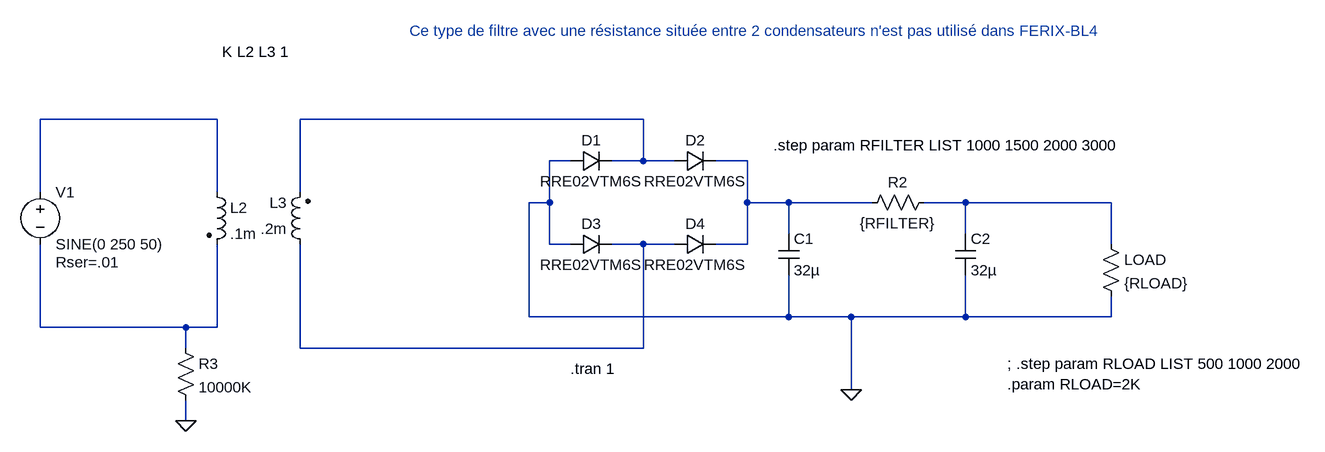
[diagram p0: schematic RectifierHT2.asc]
RectifierHT2.asc, the LTspice schematic file:
Version 4
SHEET 1 1316 692
WIRE -384 16 -656 16
WIRE 272 16 -256 16
WIRE 160 80 128 80
WIRE 272 80 272 16
WIRE 272 80 224 80
WIRE 320 80 272 80
WIRE 432 80 384 80
WIRE -656 128 -656 16
WIRE -384 128 -384 16
WIRE -256 128 -256 16
WIRE 128 144 128 80
WIRE 128 144 96 144
WIRE 432 144 432 80
WIRE 496 144 432 144
WIRE 624 144 496 144
WIRE 768 144 704 144
WIRE 992 144 768 144
WIRE 496 192 496 144
WIRE 768 192 768 144
WIRE 128 208 128 144
WIRE 160 208 128 208
WIRE 272 208 224 208
WIRE 320 208 272 208
WIRE 432 208 432 144
WIRE 432 208 384 208
WIRE 992 208 992 144
WIRE 96 320 96 144
WIRE 496 320 496 256
WIRE 496 320 96 320
WIRE 592 320 496 320
WIRE 768 320 768 256
WIRE 768 320 592 320
WIRE 992 320 992 288
WIRE 992 320 768 320
WIRE -656 336 -656 208
WIRE -432 336 -656 336
WIRE -384 336 -384 208
WIRE -384 336 -432 336
WIRE -432 368 -432 336
WIRE -256 368 -256 208
WIRE 272 368 272 208
WIRE 272 368 -256 368
WIRE 592 432 592 320
WIRE -432 480 -432 448
FLAG 592 432 0
FLAG -432 480 0
SYMBOL diode 160 96 R270
WINDOW 0 32 32 VTop 2
WINDOW 3 0 32 VBottom 2
SYMATTR InstName D1
SYMATTR Value RRE02VTM6S
SYMBOL diode 320 96 R270
WINDOW 0 32 32 VTop 2
WINDOW 3 0 32 VBottom 2
SYMATTR InstName D2
SYMATTR Value RRE02VTM6S
SYMBOL diode 160 224 R270
WINDOW 0 32 32 VTop 2
WINDOW 3 0 32 VBottom 2
SYMATTR InstName D3
SYMATTR Value RRE02VTM6S
SYMBOL diode 320 224 R270
WINDOW 0 32 32 VTop 2
WINDOW 3 0 32 VBottom 2
SYMATTR InstName D4
SYMATTR Value RRE02VTM6S
SYMBOL voltage -656 112 R0
WINDOW 123 0 0 Left 0
WINDOW 39 24 124 Left 2
SYMATTR SpiceLine Rser=.01
SYMATTR InstName V1
SYMATTR Value SINE(0 250 50)
SYMBOL res 976 192 R0
SYMATTR InstName LOAD
SYMATTR Value {RLOAD}
SYMBOL cap 480 192 R0
SYMATTR InstName C1
SYMATTR Value 32µ
SYMBOL ind2 -400 112 R0
SYMATTR InstName L2
SYMATTR Value .1m
SYMATTR Type ind
SYMBOL ind2 -240 224 R180
WINDOW 0 36 80 Left 2
WINDOW 3 36 40 Left 2
SYMATTR InstName L3
SYMATTR Value .2m
SYMATTR Type ind
SYMBOL res -448 352 R0
SYMATTR InstName R3
SYMATTR Value 10000K
SYMBOL cap 752 192 R0
SYMATTR InstName C2
SYMATTR Value 32µ
SYMBOL res 720 128 R90
WINDOW 0 0 56 VBottom 2
WINDOW 3 32 56 VTop 2
SYMATTR InstName R2
SYMATTR Value {RFILTER}
TEXT 160 400 Left 2 !.tran 1
TEXT -376 -88 Left 2 !K L2 L3 1
TEXT 832 392 Left 2 !; .step param RLOAD LIST 500 1000 2000\n.param RLOAD=2K
TEXT 472 56 Left 2 !.step param RFILTER LIST 1000 1500 2000 3000
TEXT -88 -120 Left 2 ;Ce type de filtre avec une résistance située entre 2 condensateurs n'est pas utilisé dans FERIX-BL4

The netlist it stands for:
* RectifierHT2.asc
D1 0 N002 RRE02VTM6S
D2 N002 N003 RRE02VTM6S
D3 0 N005 RRE02VTM6S
D4 N005 N003 RRE02VTM6S
V1 N001 N006 SINE(0 250 50) Rser=.01
R§LOAD N004 0 {RLOAD}
C1 N003 0 32µ
L2 N001 N006 .1m
L3 N005 N002 .2m
R3 N006 0 10000K
C2 N004 0 32µ
R2 N004 N003 {RFILTER}
.model D D
.lib standard.dio
.tran 1
K L2 L3 1
; .step param RLOAD LIST 500 1000 2000
.param RLOAD=2K
.step param RFILTER LIST 1000 1500 2000 3000
* Ce type de filtre avec une résistance située entre 2 condensateurs n'est pas utilisé dans FERIX-BL4
.backanno
.end